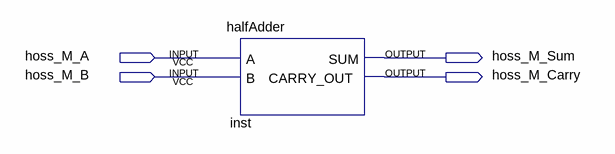
[diagram p0: schematic sheet]
// Quartus schematic halfAdderSymbol.bdf as structural Verilog: 1 symbols, 4 pins
module halfAdderSymbol (
  input  hoss_M_A,
  input  hoss_M_B,
  output hoss_M_Sum,
  output hoss_M_Carry
);

  halfAdder inst (.A(hoss_M_A), .B(hoss_M_B), .SUM(hoss_M_Sum), .CARRY_OUT(hoss_M_Carry));
endmodule
